# Altium schematic sheet Power.SchDoc
size A4
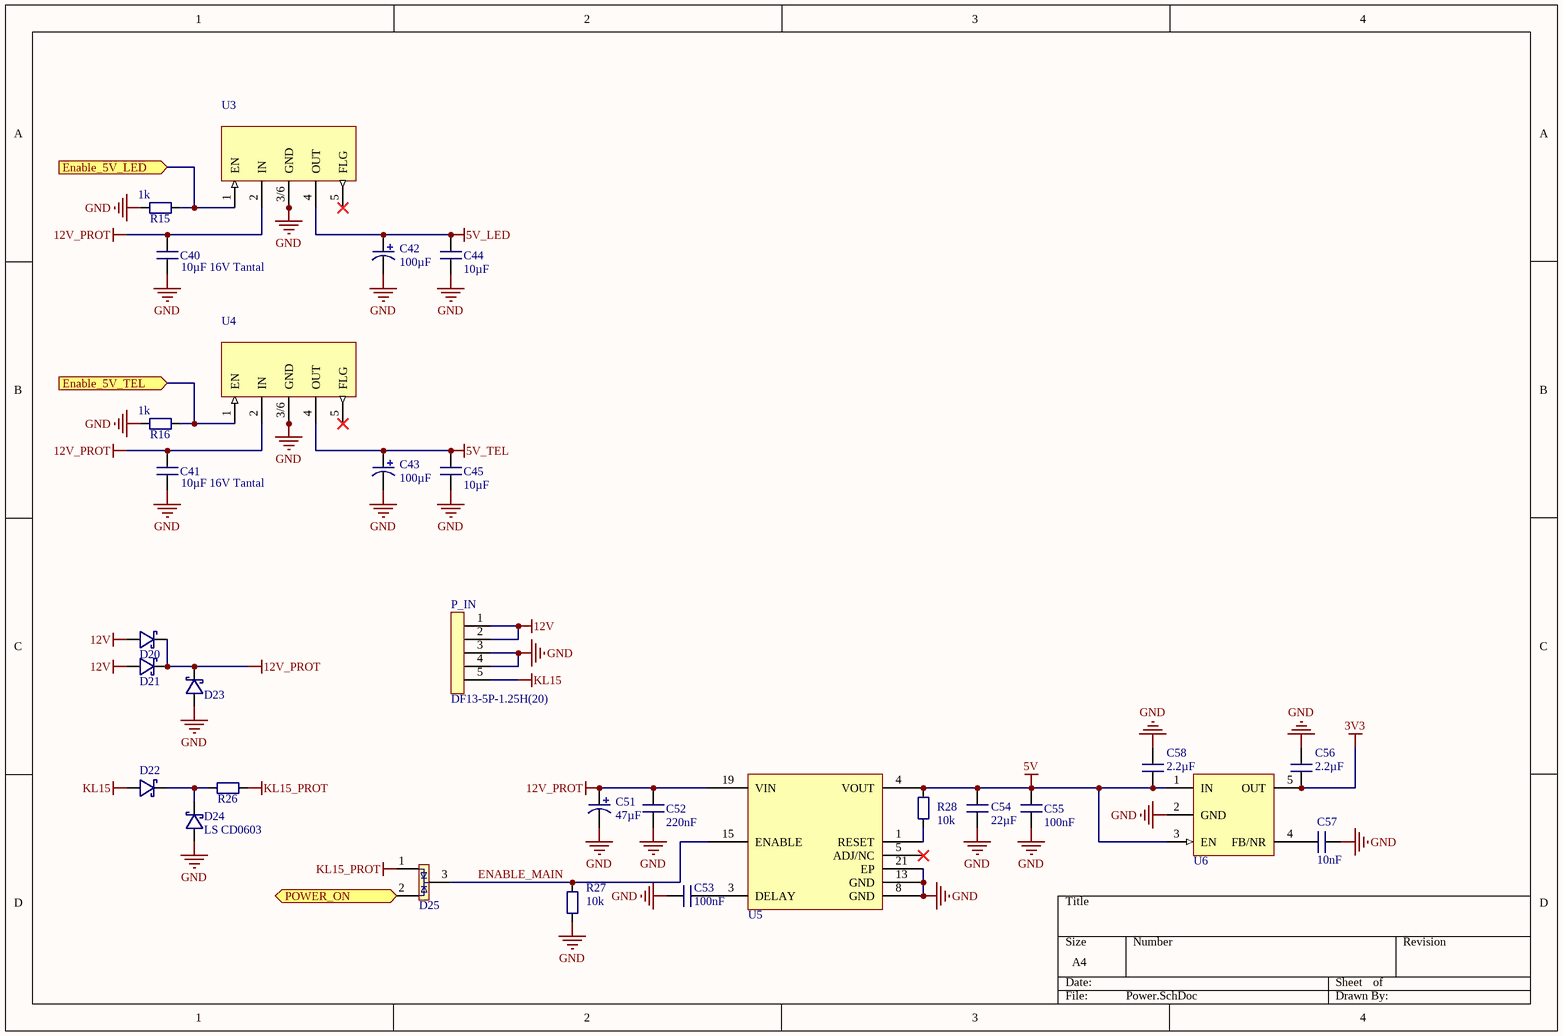
[diagram p0: Power.SchDoc]

## Parts
C40  10µF 16V Tantal  [C1206H08_M]
C41  10µF 16V Tantal  [C1206H08_M]
C42  100µF  [C1210_TANTAL_M]
C43  100µF  [C1210_TANTAL_M]
C44  10µF  [C0603H08_L]
C45  10µF  [C0603H08_L]
C51  47µF  [C1210_TANTAL_M]
C52  220nF  [C0805H085_L]
C53  100nF  [C0603H08_M]
C54  22µF  [C1210H125_M]
C55  100nF  [C0603H08_M]
C56  2.2µF  [C0603H08_M]
C57  10nF  [C0603H08_M]
C58  2.2µF  [C0603H08_M]
D20  LS PMEG6020ER  [SOD-123W]  (value not drawn)
D21  LS PMEG6020ER  [SOD-123W]  (value not drawn)
D22  LS CD0603  [CD 0603]  (value not drawn)
D23  LS PMEG6020ER  [SOD-123W]  (value not drawn)
D24  LS CD0603  [CD 0603]
D25  Diode Array BAT_54C  [SOT95P245X110-3N]  (value not drawn)
P_IN  DF13-5P-1.25H(20)  [DF13-5P-1.25H(20)]
R15  1k  [R0603H05_M]
R16  1k  [R0603H05_M]
R26  .Resistor  [R0603H05_M]  (value not drawn)
R27  10k  [R0603H05_M]
R28  10k  [R0603H05_M]
U3  MIC29151-5.0  [5-Pin TO-263]  (value not drawn)
U4  MIC29151-5.0  [5-Pin TO-263]  (value not drawn)
U5  TPS7B6750  [TSOP65P640X120_HS-21N]  (value not drawn)
U6  LDO TPS799xx Ultra Low Noise, HIGH PSRR, 200mA  [SOT-23-5]  (value not drawn)

## Ports
Enable_5V_LED (in), Enable_5V_TEL (in), POWER_ON (in)

## Nets
3V3: C56.2 U6.5(OUT)
5V: C54.1 C55.2 C58.2 R28.2 U5.4(VOUT) U6.1(IN) U6.3(EN)
5V_LED: C42.1 C44.1 U3.4(OUT)
5V_TEL: C43.1 C45.1 U4.4(OUT)
12V: D20.2 D21.2 P_IN.1 P_IN.2
12V_PROT: C40.1 C41.1 C51.1 C52.2 D20.1 D21.1 D23.1 U3.2(IN) U4.2(IN) U5.19(VIN)
GND: C40.2 C41.2 C42.2 C43.2 C44.2 C45.2 C51.2 C52.1 C53.1 C54.2 C55.1 C56.1 C57.2 C58.1 D23.2 D24.1 P_IN.3 P_IN.4 R15.1 R16.1 R27.1 U3.3(GND) U3.6(GND) U4.3(GND) U4.6(GND) U5.8(GND) U5.13(GND) U5.21(EP) U6.2(GND)
KL15: D22.1 P_IN.5
KL15_PROT: D25.1(A1) R26.2
Enable_5V_LED: R15.2 U3.1(EN) ; port Enable_5V_LED
Enable_5V_TEL: R16.2 U4.1(EN) ; port Enable_5V_TEL
ENABLE_MAIN: D25.3(C1/A2) R27.2 U5.15(ENABLE)
POWER_ON: D25.2(C2) ; port POWER_ON
NetC53_2: C53.2 U5.3(DELAY)
NetC57_1: C57.1 U6.4(FB/NR)
NetD22_2: D22.2 D24.2 R26.1
NetR28_1: R28.1 U5.1(RESET)

Not connected (* = marked no-connect by the designer): U3 5(FLG)*; U4 5(FLG)*; U5 5(ADJ/NC)*

## Notes on the sheet
- (in symbol LDO MIC29151 5V 1.5A 26VIN Enable Error Flag TO-263-5) 3/6

## Library data of the parts
C40 C41 = _C 1206: Value: 10µF 16V Tantal; mouser: 581-TAJA106K016TNJ
C42 C43 = CPT 100µF 6.3V 1210 Tantal: Mouser Order Number: 581-TPSB107K006R0400; Voltage Rating: 6.3V; Mouser: http://www.mouser.de/ProductDetail/AVX/TPSB107K006R0400; Value: 100µF
C44 C45 = C 10µF 6.3V 0603 MLCC X5R: Form: 0603 [M 1608]; Tolerance: +-20%; Farnell Order Number: 1833804; Price: 0.167; Series: X5R; Voltage Rating: 6.3V; Temperature Range: -55°C to + 85°C; Temperature Coeffizient: N/A; Farnell: http://de.farnell.com/avx/06036d106mat2a/kondensator-0603-x5r-6-3v-10uf/dp/1833804; Value: 10µF
C51 = CPT 100µF 6.3V 1210 Tantal: CPT 47µF 16V 1210 Tantal; Mouser Order Number: 581-TCNT476M016R0150; Voltage Rating: 16V; Value: 47µF
C52 = C 220nF 50V 0805 MLCC  Y5V: Form: 0805 [M 2012]; Tolerance: +80%, -20%; Farnell Order Number: 1759269; Price: 0.0252; Series: V5Y; Voltage Rating: 50V; Temperature Range: -30°C to +85°C; Value: 220nF
C53 C55 = C 100nF 100V 0603 MLCC X7R: Form: 0603 [M 1608]; Temperature Coeffizient: 0ppm/°C +- 30ppm/°C; Tolerance: +-10%; Price: 0.044; Series: X7R; Voltage Rating: 100V; Temperature Range: -55°C to +125°C; Value: 100nF
C54 = _C 1210: Value: 22µF; Mouser: 80-C1210C226K9RAUTO
C56 C58 = C 2.2µF 6.3V 0603 MLCC X7R: Form: 0603 [M 1608]; Tolerance: +-10%; Farnell Order Number: 1657930; Price: 0.131; Series: X7R; Voltage Rating: 6.3V; Temperature Range: -55°C to +125°C; Temperature Coeffizient: N/A; Farnell: http://de.farnell.com/avx/06036c225kat2a/kondensator-2-2-uf-6-3v-0603-x7r/dp/1657930; Value: 2.2µF
C57 = _C 0603: Value: 10nF
D20 D21 D23 = LS PMEG6020ER: Schottky Rectifier, 2A, 60V
P_IN = Hirose DF13-5P-1.25H(20): Circuits: 5; Connector Orientation: Right Angle; Model: DF13-5P-1.25H(20); Mounting Style: SMT
R15 R16 R27 R28 = .Resistor
  R15 R16: Value: 1k
  R27 R28: Value: 10k
U3 U4 = LDO MIC29151 5V 1.5A 26VIN Enable Error Flag TO-263-5: LDO  5V 1.5A, EN, ERR
U5 = LDO TPS7B6750 5V High-Voltage 450mA Enable: LDO  5V High-Voltage 450mA Enable
U6 = LDO TPS799xx Ultra Low Noise, HIGH PSRR, 200mA: 200mA, Low Quiescent Current, Ultra-Low Noise, High PSRR  Low Dropout Linear Regulator; Farnell Order Number: 1135403; Price: 0.707; Farnell: http://de.farnell.com/texas-instruments/tps79933ddct/v-reg-ldo-0-2a-3-3v-79933-sot5/dp/1135403